# Altium schematic sheet KeyBoard.SchDoc
size A1
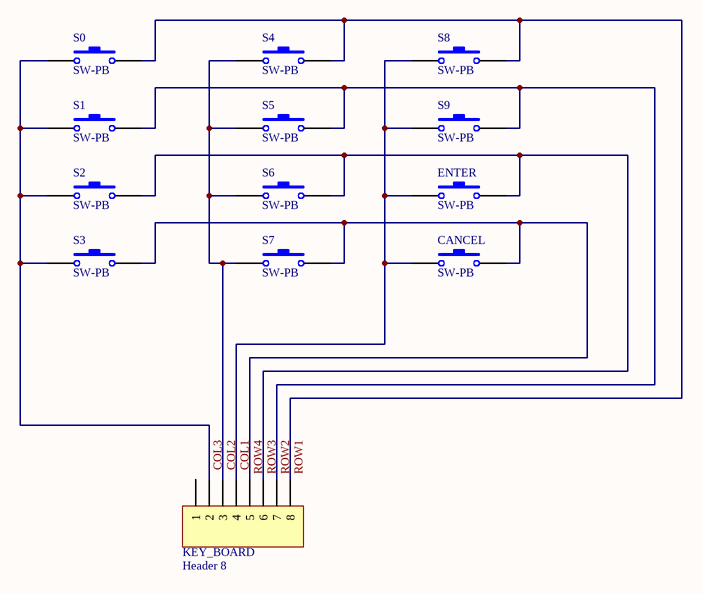
[diagram p0: KeyBoard.SchDoc]

## Parts
CANCEL  SW-PB  [BUTTON]
ENTER  SW-PB  [BUTTON]
KEY_BOARD  Header 8  [Cap_8]
S0  SW-PB  [BUTTON]
S1  SW-PB  [BUTTON]
S2  SW-PB  [BUTTON]
S3  SW-PB  [BUTTON]
S4  SW-PB  [BUTTON]
S5  SW-PB  [BUTTON]
S6  SW-PB  [BUTTON]
S7  SW-PB  [BUTTON]
S8  SW-PB  [BUTTON]
S9  SW-PB  [BUTTON]

## Nets
COL1: CANCEL.1 ENTER.1 KEY_BOARD.4 S8.1 S9.1
COL2: KEY_BOARD.3 S4.1 S5.1 S6.1 S7.1
COL3: KEY_BOARD.2 S0.1 S1.1 S2.1 S3.1
ROW1: KEY_BOARD.8 S0.2 S4.2 S8.2
ROW2: KEY_BOARD.7 S1.2 S5.2 S9.2
ROW3: ENTER.2 KEY_BOARD.6 S2.2 S6.2
ROW4: CANCEL.2 KEY_BOARD.5 S3.2 S7.2

Not connected (* = marked no-connect by the designer): KEY_BOARD 1

## Library data of the parts
CANCEL ENTER S0-S9 = SW-PB: Switch; Published: 24-Mar-1999; LatestRevisionDate: 17-Jul-2002; LatestRevisionNote: Re-released for DXP Platform.; PackageReference: SPST-2; Publisher: Altium Limited
KEY_BOARD = Header 8: Header, 8-Pin; LatestRevisionDate: 17-Jul-2002; LatestRevisionNote: Re-released for DXP Platform.; Publisher: Altium Limited